# Altium schematic sheet ethernet.SchDoc
size B
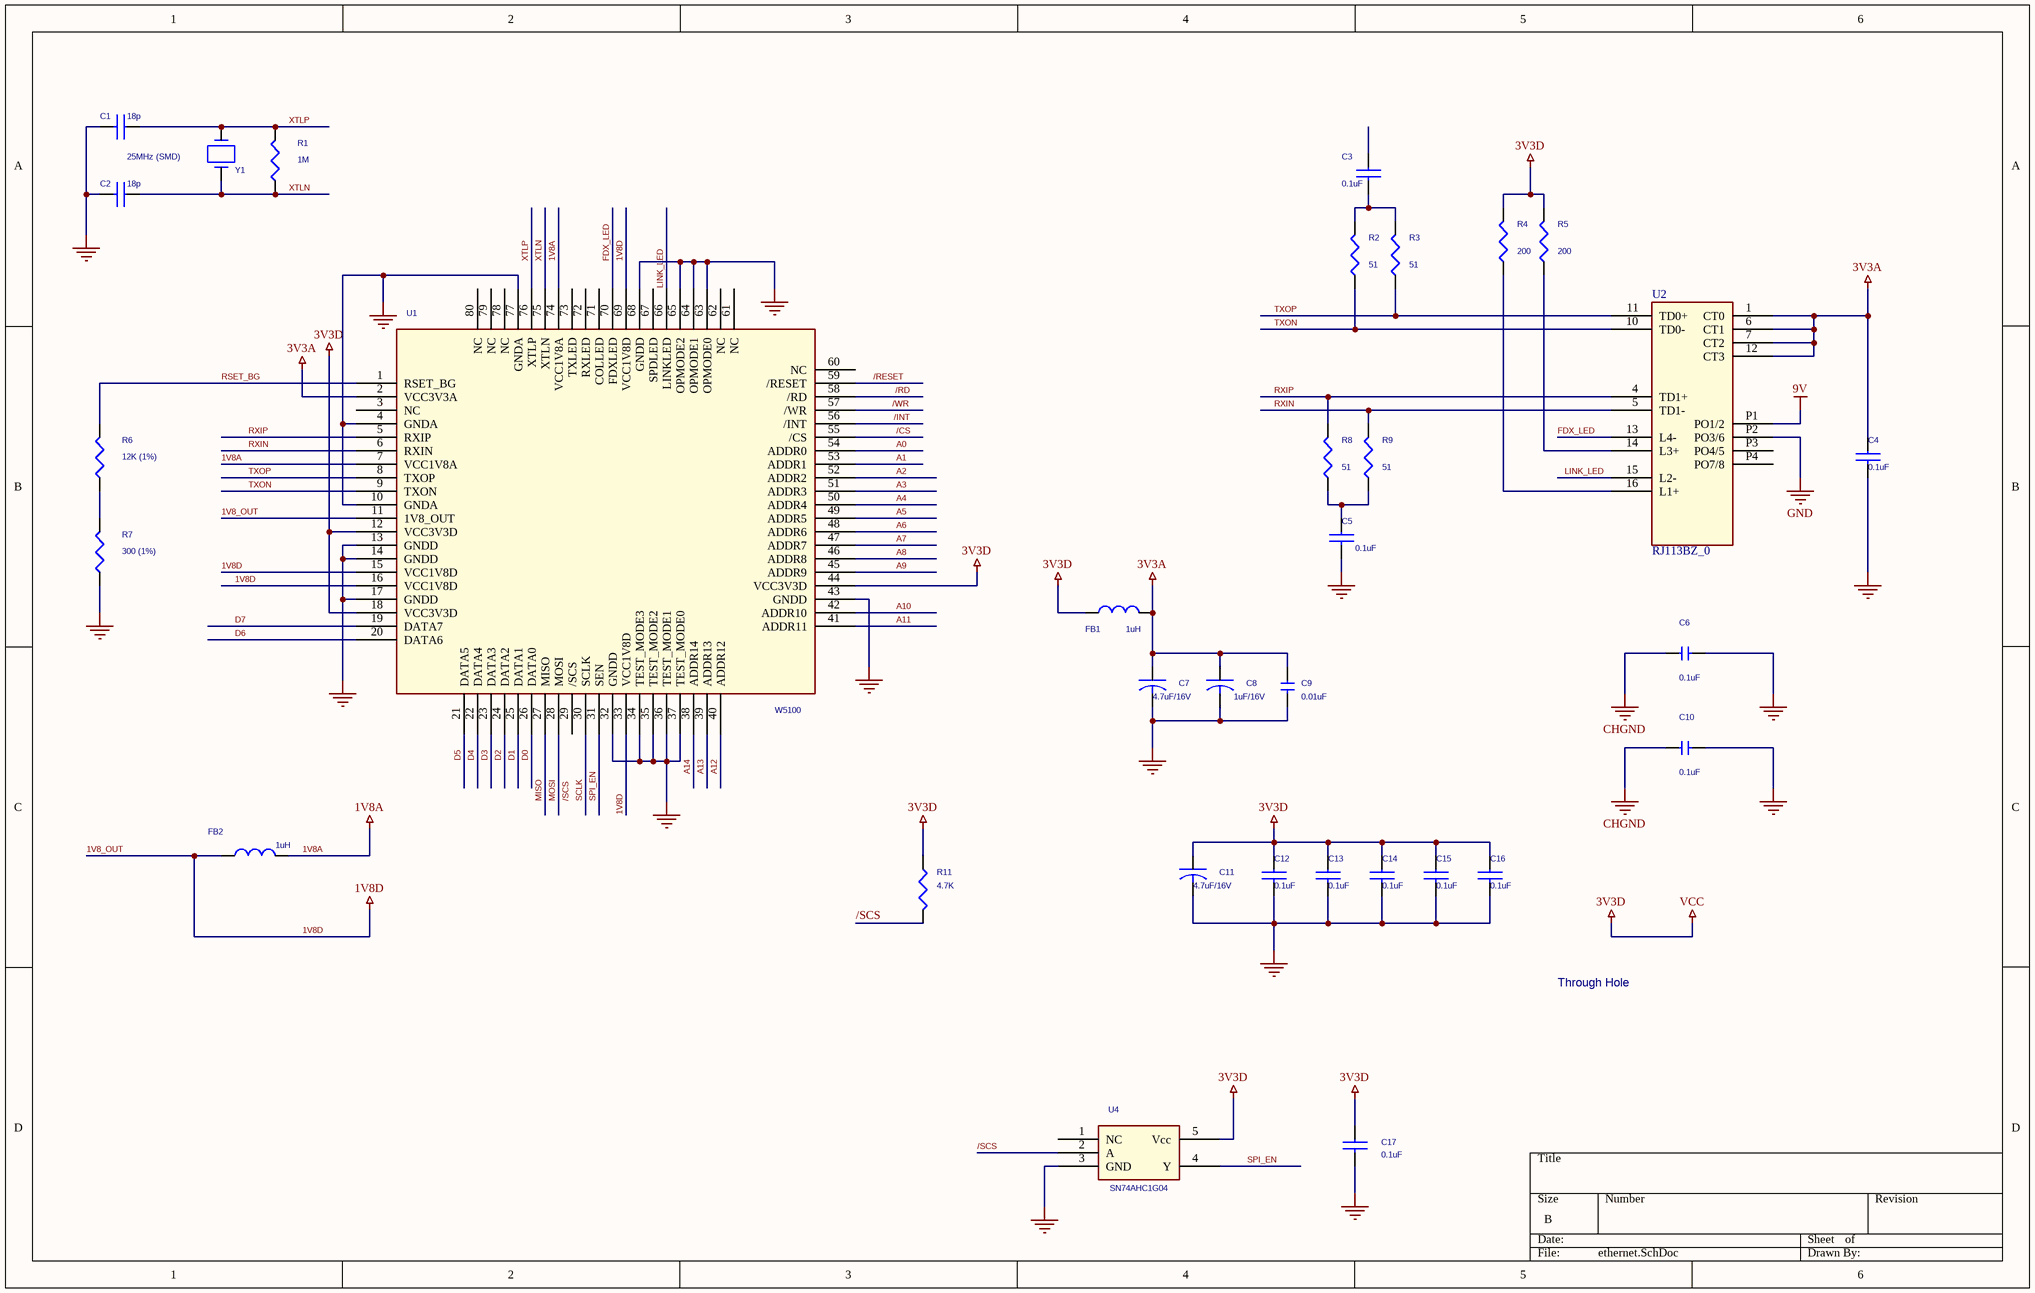
[diagram p0: ethernet.SchDoc]

## Parts
C1  18p
C2  18p
C3  0.1uF
C4  0.1uF
C5  0.1uF
C6  0.1uF  [C0603]
C7  4.7uF/16V  [CAP\B\3528]
C8  1uF/16V  [CAP\A\3216]
C9  0.01uF  [C0603]
C10  0.1uF  [C0603]
C11  4.7uF/16V  [CAP\B\3528]
C12  0.1uF
C13  0.1uF
C14  0.1uF
C15  0.1uF
C16  0.1uF
C17  0.1uF
FB1  1uH  [L0805]
FB2  1uH  [L0805]
R1  1M
R2  51
R3  51
R4  200
R5  200
R6  12K (1%)
R7  300 (1%)
R8  51
R9  51
R11  4.7K
U1  W5100
U2  RJ113BZ_0
U4  SN74AHC1G04
Y1  25MHz (SMD)

## Nets
1V8_OUT: FB2.1 U1.11(1V8_OUT) U1.15(VCC1V8D) U1.16(VCC1V8D) U1.33(VCC1V8D) U1.69(VCC1V8D)  [also labelled 1V8D]
1V8A: FB2.2 U1.7(VCC1V8A) U1.74(VCC1V8A)
3V3A: C4.1 C7.1 C8.1 C9.1 FB1.2 U1.2(VCC3V3A) U2.1(CT0) U2.6(CT1) U2.7(CT2) U2.12(CT3)
3V3D: C11.1 C12.1 C13.1 C14.1 C15.1 C16.1 C17.1 FB1.1 R4.2 R5.2 R11.1 U1.12(VCC3V3D) U1.18(VCC3V3D) U1.44(VCC3V3D) U4.5(Vcc)  [also labelled VCC]
9V: U2.P1(PO1/2)
CHGND: C6.1 C10.1
GND: C1.2 C2.2 C4.2 C5.2 C6.2 C7.2 C8.2 C9.2 C10.2 C11.2 C12.2 C13.2 C14.2 C15.2 C16.2 C17.2 R7.1 U1.4(GNDA) U1.10(GNDA) U1.13(GNDD) U1.14(GNDD) U1.17(GNDD) U1.32(GNDD) U1.34(TEST_MODE3) U1.35(TEST_MODE2) U1.36(TEST_MODE1) U1.37(TEST_MODE0) U1.43(GNDD) U1.63(OPMODE0) U1.64(OPMODE1) U1.65(OPMODE2) U1.68(GNDD) U1.77(GNDA) U2.P2(PO3/6) U4.3(GND)
/CS: U1.55(/CS)
/INT: U1.56(/INT)
/RD: U1.58(/RD)
/RESET: U1.59(/RESET)
/SCS: R11.2 U4.2(A)
/WR: U1.57(/WR)
A0: U1.54(ADDR0)
A1: U1.53(ADDR1)
A2: U1.52(ADDR2)
A3: U1.51(ADDR3)
A4: U1.50(ADDR4)
A5: U1.49(ADDR5)
A6: U1.48(ADDR6)
A7: U1.47(ADDR7)
A8: U1.46(ADDR8)
A9: U1.45(ADDR9)
A10: U1.42(ADDR10)
A11: U1.41(ADDR11)
A12: U1.40(ADDR12)
A13: U1.39(ADDR13)
A14: U1.38(ADDR14)
D0: U1.26(DATA0)
D1: U1.25(DATA1)
D2: U1.24(DATA2)
D3: U1.23(DATA3)
D4: U1.22(DATA4)
D5: U1.21(DATA5)
D6: U1.20(DATA6)
D7: U1.19(DATA7)
FDX_LED: U1.70(FDXLED) U2.13(L4-)
LINK_LED: U1.66(LINKLED) U2.15(L2-)
MISO: U1.27(MISO)
MOSI: U1.28(MOSI)
RSET_BG: R6.2 U1.1(RSET_BG)
RXIN: R9.2 U1.6(RXIN) U2.5(TD1-)
RXIP: R8.2 U1.5(RXIP) U2.4(TD1+)
SCLK: U1.30(SCLK)
SPI_EN: U1.31(SEN) U4.4(Y)
TXON: R2.1 U1.9(TXON) U2.10(TD0-)
TXOP: R3.1 U1.8(TXOP) U2.11(TD0+)
XTLN: C2.1 R1.1 U1.75(XTLN) Y1.2
XTLP: C1.1 R1.2 U1.76(XTLP) Y1.1
NetC3_2: C3.2 R2.2 R3.2
NetC5_1: C5.1 R8.1 R9.1
NetR4_1: R4.1 U2.16(L1+)
NetR5_1: R5.1 U2.14(L3+)
NetR6_1: R6.1 R7.2

Not connected (* = marked no-connect by the designer): C3 1; U1 3(NC) 29(/SCS) 60(NC) 61(NC) 62(NC) 67(SPDLED) 71(COLLED) 72(RXLED) 73(TXLED) 78(NC) 79(NC) 80(NC); U2 P3(PO4/5) P4(PO7/8); U4 1(NC)

## Notes on the sheet
- Through Hole
- Labels drawn without touching a wire or pin: /SCS

## Library data of the parts
C1-C5 C12-C17 = CAP NP
C6 C9 C10 = CAP_0.01uF_0603
C7 C11 = CAP_4.7uF_B
C8 = CAP_1uF_A
FB1 FB2 = FB_0805
R1 R6 R7 = R_Dup1
R2-R5 R8 R9 R11 = R
U1 = W5100_7
Y1 = CRYSTAL